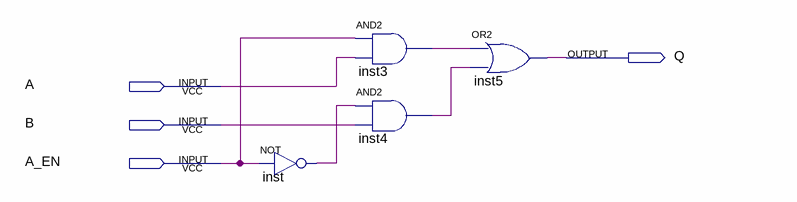
[diagram p0: schematic sheet]
// Quartus schematic nano_selector.bdf as structural Verilog: 4 symbols, 4 pins
module nano_selector (
  input  A,
  input  B,
  input  A_EN,
  output Q
);

  wire inst3_out, inst4_out, inst_out;

  not inst (inst_out, A_EN);
  and inst3 (inst3_out, A_EN, A);
  and inst4 (inst4_out, inst_out, B);
  or inst5 (Q, inst3_out, inst4_out);
endmodule
